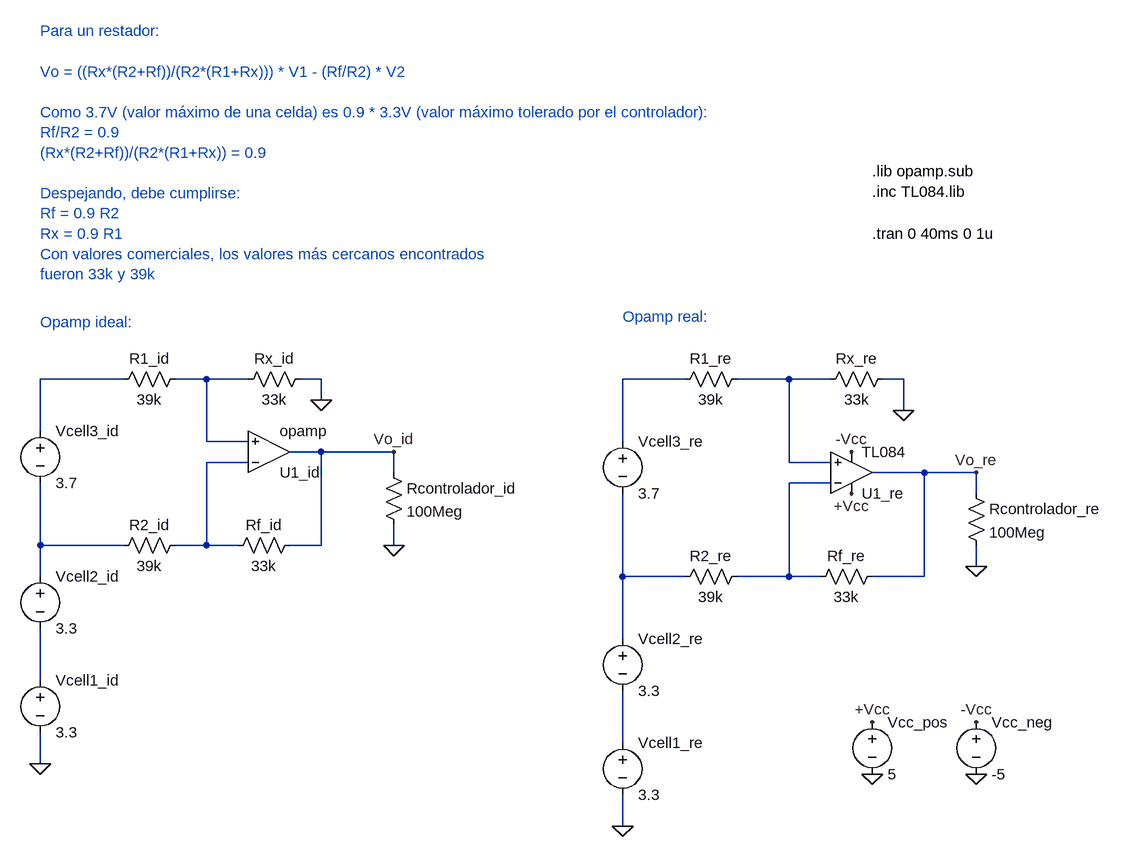
[diagram p0: schematic Opamps en modo restador.asc]
Opamps en modo restador.asc, the LTspice schematic file:
Version 4.1
SHEET 1 2216 1480
WIRE 208 -944 80 -944
WIRE 336 -944 288 -944
WIRE 400 -944 336 -944
WIRE 512 -944 480 -944
WIRE 1072 -944 976 -944
WIRE 1232 -944 1152 -944
WIRE 1296 -944 1232 -944
WIRE 1408 -944 1376 -944
WIRE 512 -912 512 -944
WIRE 1408 -896 1408 -944
WIRE 80 -864 80 -944
WIRE 336 -848 336 -944
WIRE 400 -848 336 -848
WIRE 976 -848 976 -944
WIRE 512 -832 464 -832
WIRE 624 -832 512 -832
WIRE 400 -816 336 -816
WIRE 1232 -816 1232 -944
WIRE 1296 -816 1232 -816
WIRE 624 -800 624 -832
WIRE 1440 -800 1360 -800
WIRE 1520 -800 1440 -800
WIRE 1296 -784 1232 -784
WIRE 1520 -768 1520 -800
WIRE 80 -688 80 -784
WIRE 208 -688 80 -688
WIRE 336 -688 336 -816
WIRE 336 -688 288 -688
WIRE 384 -688 336 -688
WIRE 512 -688 512 -832
WIRE 512 -688 464 -688
WIRE 624 -688 624 -720
WIRE 1520 -656 1520 -688
WIRE 80 -640 80 -688
WIRE 976 -640 976 -768
WIRE 1072 -640 976 -640
WIRE 1232 -640 1232 -784
WIRE 1232 -640 1152 -640
WIRE 1280 -640 1232 -640
WIRE 1440 -640 1440 -800
WIRE 1440 -640 1360 -640
WIRE 976 -544 976 -640
WIRE 80 -480 80 -560
WIRE 976 -384 976 -464
WIRE 80 -352 80 -400
WIRE 976 -256 976 -304
FLAG 512 -912 0
FLAG 624 -688 0
FLAG 80 -352 0
FLAG 624 -832 Vo_id
FLAG 1408 -896 0
FLAG 1520 -656 0
FLAG 976 -256 0
FLAG 1520 -800 Vo_re
FLAG 1360 -336 0
FLAG 1520 -336 0
FLAG 1360 -416 +Vcc
FLAG 1520 -416 -Vcc
FLAG 1328 -768 +Vcc
FLAG 1328 -832 -Vcc
SYMBOL OpAmps\\opamp 432 -768 M180
SYMATTR InstName U1_id
SYMBOL voltage 80 -880 R0
SYMATTR InstName Vcell3_id
SYMATTR Value 3.7
SYMBOL res 304 -960 R90
WINDOW 0 0 56 VBottom 2
WINDOW 3 32 56 VTop 2
SYMATTR InstName R1_id
SYMATTR Value 39k
SYMBOL res 304 -704 R90
WINDOW 0 0 56 VBottom 2
WINDOW 3 32 56 VTop 2
SYMATTR InstName R2_id
SYMATTR Value 39k
SYMBOL res 480 -704 R90
WINDOW 0 0 56 VBottom 2
WINDOW 3 32 56 VTop 2
SYMATTR InstName Rf_id
SYMATTR Value 33k
SYMBOL res 496 -960 R90
WINDOW 0 0 56 VBottom 2
WINDOW 3 32 56 VTop 2
SYMATTR InstName Rx_id
SYMATTR Value 33k
SYMBOL res 608 -816 R0
SYMATTR InstName Rcontrolador_id
SYMATTR Value 100Meg
SYMBOL voltage 80 -656 R0
SYMATTR InstName Vcell2_id
SYMATTR Value 3.3
SYMBOL voltage 80 -496 R0
SYMATTR InstName Vcell1_id
SYMATTR Value 3.3
SYMBOL voltage 976 -864 R0
SYMATTR InstName Vcell3_re
SYMATTR Value 3.7
SYMBOL res 1168 -960 R90
WINDOW 0 0 56 VBottom 2
WINDOW 3 32 56 VTop 2
SYMATTR InstName R1_re
SYMATTR Value 39k
SYMBOL res 1168 -656 R90
WINDOW 0 0 56 VBottom 2
WINDOW 3 32 56 VTop 2
SYMATTR InstName R2_re
SYMATTR Value 39k
SYMBOL res 1376 -656 R90
WINDOW 0 0 56 VBottom 2
WINDOW 3 32 56 VTop 2
SYMATTR InstName Rf_re
SYMATTR Value 33k
SYMBOL res 1392 -960 R90
WINDOW 0 0 56 VBottom 2
WINDOW 3 32 56 VTop 2
SYMATTR InstName Rx_re
SYMATTR Value 33k
SYMBOL res 1504 -784 R0
SYMATTR InstName Rcontrolador_re
SYMATTR Value 100Meg
SYMBOL voltage 976 -560 R0
SYMATTR InstName Vcell2_re
SYMATTR Value 3.3
SYMBOL voltage 976 -400 R0
SYMATTR InstName Vcell1_re
SYMATTR Value 3.3
SYMBOL voltage 1360 -432 R0
SYMATTR InstName Vcc_pos
SYMATTR Value 5
SYMBOL voltage 1520 -432 R0
SYMATTR InstName Vcc_neg
SYMATTR Value -5
SYMBOL OpAmps\\opamp2 1328 -736 M180
SYMATTR InstName U1_re
SYMATTR Value TL084
TEXT 1360 -1168 Left 2 !.tran 0 40ms 0 1u
TEXT 1360 -1264 Left 2 !.lib opamp.sub\n.inc TL084.lib
TEXT 80 -1480 Left 2 ;Para un restador:\n \nVo = ((Rx*(R2+Rf))/(R2*(R1+Rx))) * V1 - (Rf/R2) * V2\n \nComo 3.7V (valor máximo de una celda) es 0.9 * 3.3V (valor máximo tolerado por el controlador):\nRf/R2 = 0.9\n(Rx*(R2+Rf))/(R2*(R1+Rx)) = 0.9\n \nDespejando, debe cumplirse:\nRf = 0.9 R2\nRx = 0.9 R1\nCon valores comerciales, los valores más cercanos encontrados\nfueron 33k y 39k
TEXT 80 -1032 Left 2 ;Opamp ideal:
TEXT 976 -1040 Left 2 ;Opamp real:

The netlist it stands for:
* Opamps en modo restador.asc
X§U1_id N005 N002 Vo_id opamp Aol=100K GBW=10Meg  ; pins invin noninvin out
Vcell3_id N001 N007 3.7
R1_id N002 N001 39k
R2_id N005 N007 39k
Rf_id Vo_id N005 33k
Rx_id 0 N002 33k
Rcontrolador_id Vo_id 0 100Meg
Vcell2_id N007 N009 3.3
Vcell1_id N009 0 3.3
Vcell3_re N003 N008 3.7
R1_re N004 N003 39k
R2_re N006 N008 39k
Rf_re Vo_re N006 33k
Rx_re 0 N004 33k
Rcontrolador_re Vo_re 0 100Meg
Vcell2_re N008 N010 3.3
Vcell1_re N010 0 3.3
Vcc_pos +Vcc 0 5
Vcc_neg -Vcc 0 -5
X§U1_re N004 N006 +Vcc -Vcc Vo_re TL084  ; pins In+ In- V+ V- OUT
.tran 0 40ms 0 1u
.lib opamp.sub
.inc TL084.lib
* Para un restador:
* Vo = ((Rx*(R2+Rf))/(R2*(R1+Rx))) * V1 - (Rf/R2) * V2
* Como 3.7V (valor máximo de una celda) es 0.9 * 3.3V (valor máximo tolerado por el controlador):
* Rf/R2 = 0.9
* (Rx*(R2+Rf))/(R2*(R1+Rx)) = 0.9
* Despejando, debe cumplirse:
* Rf = 0.9 R2
* Rx = 0.9 R1
* Con valores comerciales, los valores más cercanos encontrados
* fueron 33k y 39k
* Opamp ideal:
* Opamp real:
.backanno
.end